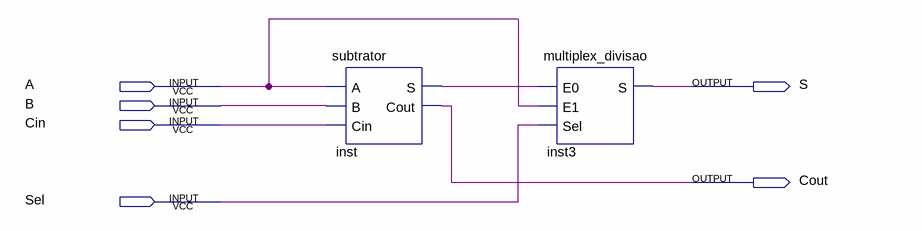
[diagram p0: schematic sheet]
// Quartus schematic divisor_1bit.bdf as structural Verilog: 2 symbols, 6 pins
module divisor_1bit (
  input  A,
  input  B,
  input  Cin,
  input  Sel,
  output S,
  output Cout
);

  wire inst_s;

  subtrator inst (.A(A), .B(B), .Cin(Cin), .S(inst_s), .Cout(Cout));
  multiplex_divisao inst3 (.E0(inst_s), .E1(A), .Sel(Sel), .S(S));
endmodule
